# EAGLE design dual uln plane_new (EAGLE 5.10)
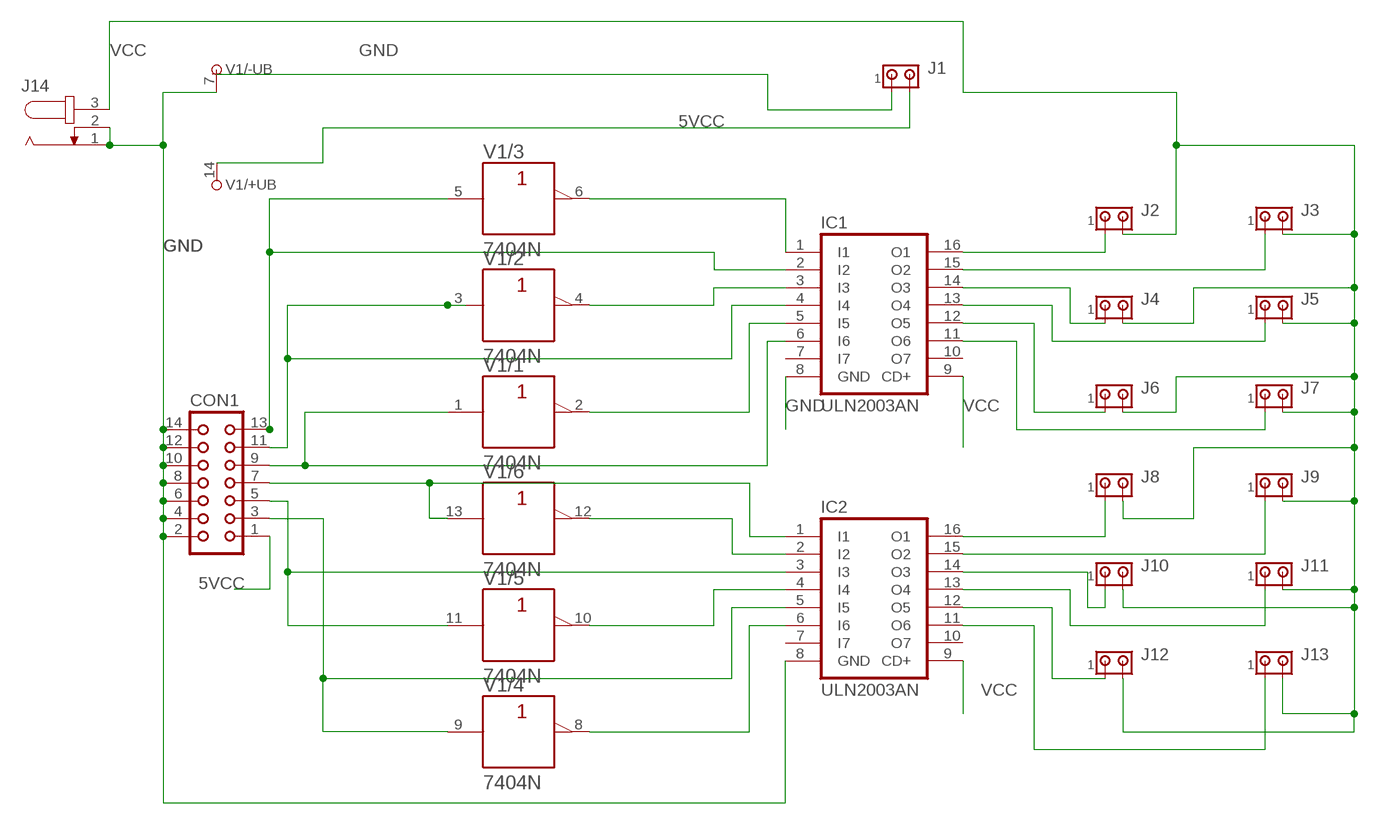
[diagram p0: schematic, sheet 1]

## Parts
CON1  CON14  [CON14]
IC1  ULN2003AN  [DIL16]
IC2  ULN2003AN  [DIL16]
J1  MTA02-100  [10X02MTA]
J2  MTA02-100  [10X02MTA]
J3  MTA02-100  [10X02MTA]
J4  MTA02-100  [10X02MTA]
J5  MTA02-100  [10X02MTA]
J6  MTA02-100  [10X02MTA]
J7  MTA02-100  [10X02MTA]
J8  MTA02-100  [10X02MTA]
J9  MTA02-100  [10X02MTA]
J10  MTA02-100  [10X02MTA]
J11  MTA02-100  [10X02MTA]
J12  MTA02-100  [10X02MTA]
J13  MTA02-100  [10X02MTA]
J14  JACK-PLUG1  [SPC4078]
V1  7404N  [DIL14]

## Nets
5VCC: CON1.1 J1.2 V1.14(/+UB:+UB)
GND: CON1.2 CON1.4 CON1.6 CON1.8 CON1.10 CON1.12 CON1.14 IC1.8(GND) IC2.8(GND) J1.1 J14.1 J14.2 V1.7(/-UB:-UB)
N$1: IC1.3(I3) V1.4(/2:Y)
N$2: IC1.5(I5) V1.2(/1:Y)
N$3: CON1.13 IC1.2(I2) V1.5(/3:A)
N$4: CON1.7 IC2.1(I1) V1.13(/6:A)
N$5: CON1.11 IC1.4(I4) V1.3(/2:A)
N$6: IC1.1(I1) V1.6(/3:Y)
N$7: CON1.9 IC1.6(I6) V1.1(/1:A)
N$9: CON1.5 IC2.3(I3) V1.11(/5:A)
N$10: CON1.3 IC2.5(I5) V1.9(/4:A)
N$12: IC2.2(I2) V1.12(/6:Y)
N$13: IC2.4(I4) V1.10(/5:Y)
N$14: IC2.6(I6) V1.8(/4:Y)
N$15: IC1.16(O1) J2.1
N$16: IC1.15(O2) J3.1
N$17: IC1.14(O3) J4.1
N$18: IC1.13(O4) J5.1
N$19: IC1.12(O5) J6.1
N$20: IC1.11(O6) J7.1
N$21: IC2.16(O1) J8.1
N$22: IC2.15(O2) J9.1
N$23: IC2.14(O3) J10.1
N$24: IC2.13(O4) J11.1
N$25: IC2.12(O5) J12.1
N$26: IC2.11(O6) J13.1
VCC: IC1.9(CD+) IC2.9(CD+) J2.2 J3.2 J4.2 J5.2 J6.2 J7.2 J8.2 J9.2 J10.2 J11.2 J12.2 J13.2 J14.3
Unconnected: IC1.7(I7) IC1.10(O7) IC2.7(I7) IC2.10(O7)

## Library data of the parts
CON1 = con-harting:CON14: CONNECTOR
IC1 IC2 = uln-udn:ULN2003A: DRIVER ARRAY
J1-J13 = con-amp:MTA02-100: AMP connector
J14 = con-jack:JACK-PLUG: DC POWER JACK Power Jack, DC, Right Angle, Through Hole, Rated 5A at 16VDC, PC Terminals Distributor: Farnell (www.Farnell.de) Drawing: 84N1161.pdf / 84N1162.pdf Manufacturer: SPC Technology (www.spctechnology.com) Type: SPC4077 / SPC 4078
V1 = 74ttl-din:74*04: Hex INVERTER

## Board
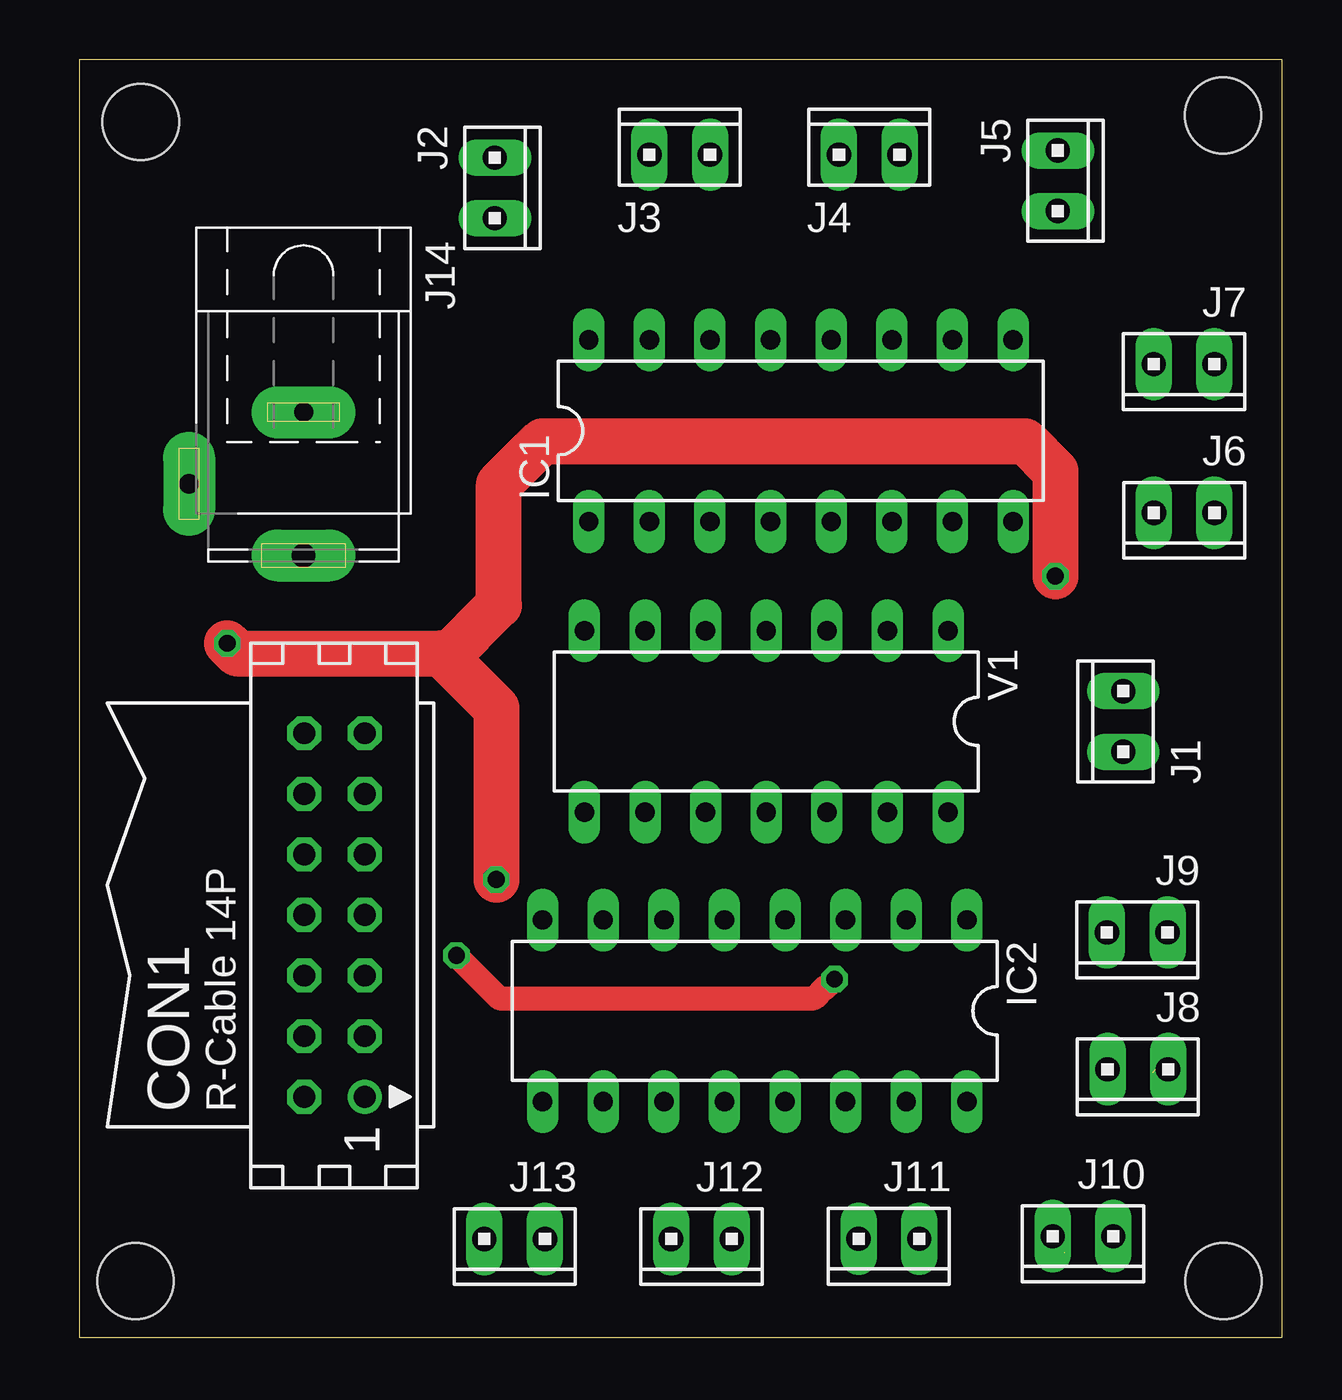
[diagram p1: board, top side]
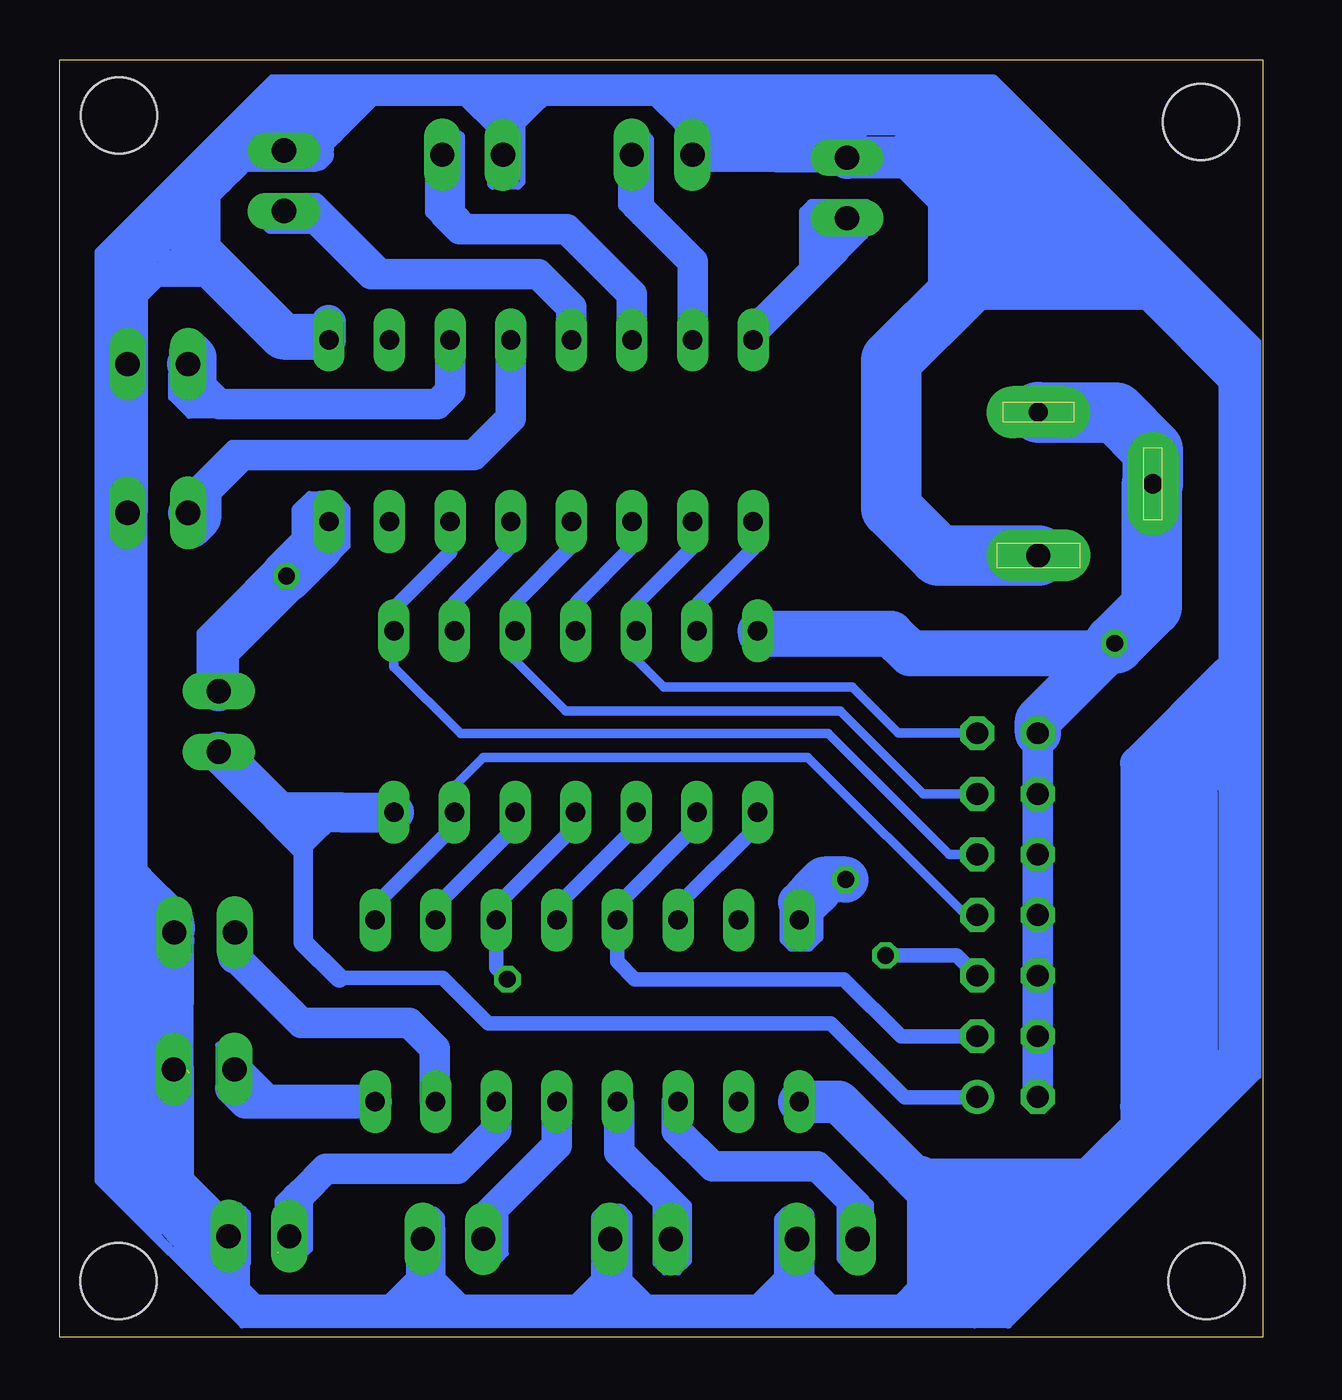
[diagram p2: board, bottom side, seen from below]

Size 50.41 x 53.57 mm. Coordinates in mm from the lower left corner, seen from the top.
Outline: 0,0 50.41,0 50.41,53.57 0,53.57 0,0
Copper layers (1*16): Top 0.035mm / dielectric 1.5mm / Bottom 0.035mm
Design rules "default *": minimum track width 10mil, minimum drill 24mil, track to track 50mil, track to pad 80mil, pad to pad 80mil, via to via 80mil, smd to smd 98mil, copper to edge 40mil, drill to drill 8mil, minimum pad ring 10mil, minimum via ring 8mil, stop-mask expansion 4mil, vias tented up to drill 0mil, thermal gap 10mil
Holes 3.2 mm at 2.58,50.95 2.35,2.36 47.95,2.36 47.93,51.23

### Footprints (pad centres in the part's own frame; a part is rotated, then mirrored left to right if it is on the bottom)
CON14 = drill 0.914 round: 1 -7.62,-1.27 | drill 0.914 octagon: 2 -7.62,1.27; 3 -5.08,-1.27; 4 -5.08,1.27; 5 -2.54,-1.27; 6 -2.54,1.27; 7 0,-1.27; 8 0,1.27; 9 2.54,-1.27; 10 2.54,1.27; 11 5.08,-1.27; 12 5.08,1.27; 13 7.62,-1.27; 14 7.62,1.27
DIL16 = drill 0.813 long: 1 -8.89,-3.81; 2 -6.35,-3.81; 3 -3.81,-3.81; 4 -1.27,-3.81; 5 1.27,-3.81; 6 3.81,-3.81; 7 6.35,-3.81; 8 8.89,-3.81; 9 8.89,3.81; 10 6.35,3.81; 11 3.81,3.81; 12 1.27,3.81; 13 -1.27,3.81; 14 -3.81,3.81; 15 -6.35,3.81; 16 -8.89,3.81
10X02MTA = drill 1.016 long: 1 1.27,0; 2 -1.27,0
SPC4078 = drill 0.8 pad 2.184 long: 1 -3,0; 2 0,-4.8 | drill 1 pad 2.184 long: 3 3,0
DIL14 = drill 0.813 long: 1 -7.62,-3.81; 2 -5.08,-3.81; 3 -2.54,-3.81; 4 0,-3.81; 5 2.54,-3.81; 6 5.08,-3.81; 7 7.62,-3.81; 8 7.62,3.81; 9 5.08,3.81; 10 2.54,3.81; 11 0,3.81; 12 -2.54,3.81; 13 -5.08,3.81; 14 -7.62,3.81

### Placement (x,y rotation side)
CON1  10.69,17.71 90 top
IC1  30.24,38.01 0 top
IC2  28.31,13.69 180 top
J1  43.75,25.82 90 top
J2  17.41,48.19 270 top
J3  25.16,49.58 0 top
J4  33.11,49.58 0 top
J5  41.01,48.49 270 top
J6  46.3,34.57 180 top
J7  46.3,40.8 180 top
J8  44.36,11.24 180 top
J9  44.34,16.98 180 top
J10  42.06,4.24 180 top
J11  33.93,4.13 180 top
J12  26.07,4.12 180 top
J13  18.24,4.12 180 top
J14  9.4,35.78 270 top
V1  28.79,25.82 180 top

### Tracks (layer width: path | path; a pad name or v marks a point on that pad's centre or on a via)
5VCC
  Bottom 0.305: 41.25,21.31 40.35,20.41 40.2,20.41 | 40.15,20.51 40.18,20.49 | 40.2,20.01 41.65,21.46
  Bottom 0.61: 40.2,20.41 40.2,20.46 40.18,20.49 38.65,22.01 | 40.85,21.56 40.85,21.21 40.15,20.51 40.15,21.01 40.2,21.06 40.7,21.06 41,21.36 | 38.7,15.06 34.35,15.06 32.45,13.16 18.1,13.16 15,10.06 11.99,10.06 CON1.1
  Bottom 0.813: 40.2,20.41 40.2,20.01 40.2,16.56 38.7,15.06
  Bottom 1.676: V1.14 38.65,22.01 41.21,22.01 J1.2
GND  (via drill 0.7)
  Top 1.93: v6.2,29.09 6.62,28.67 15.18,28.67 15.37,28.48 | v40.9,31.91 40.9,36.3 39.63,37.57 19.4,37.57 17.58,35.75 17.58,30.69 15.37,28.48 | v17.47,19.19 17.47,26.38 15.37,28.48
  Bottom 0.254: 38.45,34.36 38.45,34.06 38.35,33.96 | 38.45,34.86 38.45,33.26 38.85,32.86 38.85,32.66 38.35,33.16 38.35,33.96 | 38.45,34.86 38.35,34.76 38.35,33.96 | 38.85,35.26 38.45,34.86 | 38.85,35.26 39.45,35.26 39.55,35.36 39.05,35.36 38.85,35.16 38.85,35.26 | 38.85,35.26 38.95,35.36 39.95,35.36 40.55,34.76 40.55,33.56 44.55,29.56 44.55,27.66 | 44.55,27.56 44.55,27.66 | 44.55,27.56 44.35,27.36 44.15,27.36 | 44.15,27.36 40.45,31.06 41.15,31.06 44.55,27.66 | 44.55,27.56 44.55,27.06 44.25,26.76 | 44.15,27.36 44.02,27.36 J1.1
  Bottom 0.406: 18.6,17.31 18.6,16.76 19,16.36 19.75,16.36 20.05,16.66 20.05,18.46 19.7,18.81 | 18.6,17.31 18.6,17.76 18.65,17.76 18.8,17.91 | 18.6,17.31 19.3,17.31 19.75,16.86 19.7,16.86 19.5,16.66 19.3,16.66 19.2,16.76 19.05,16.76 18.85,16.96
  Bottom 1.016: 19.46,17.75 18.96,17.75 18.8,17.91 18.23,18.48 18.23,18.5 18.65,18.92
  Bottom 1.27: CON1.2 CON1.4 CON1.6 CON1.8 CON1.10 CON1.12 CON1.14 | 19.46,17.75 IC2.8 | v6.2,29.09 6.33,29.23
  Bottom 1.676: 19.46,18.25 19.09,18.62 18.94,18.62 | 21.03,29.49 V1.7 | J1.1 43.75,29.07 v40.9,31.91
  Bottom 1.778: IC1.8 39.58,34.2
  Bottom 1.93: 18.94,18.62 18.65,18.92 18.37,19.19 v17.47,19.19 | 21.03,29.49 15.57,29.49 14.75,28.67 6.62,28.67 v6.2,29.09 9.42,25.87 CON1.14
  Bottom 2.184: 39.58,34.2 39.58,33.23 v40.9,31.91 | 4.65,35.73 J14.2
  Bottom 2.54: J14.2 4.6,37.21 6.15,38.76 9.38,38.76 J14.1 | 4.65,35.73 4.65,30.64 v6.2,29.09
N$1
  Bottom 0.61: IC1.3 26.43,33.14 28.75,30.81 28.75,29.66 V1.4
N$2
  Bottom 0.61: IC1.5 31.51,33.16 33.85,30.81 33.85,29.64 V1.2
N$3
  Bottom 0.406: V1.5 26.25,28.41 25.1,27.26 17.2,27.26 15.27,25.33 CON1.13
  Bottom 0.61: IC1.2 23.89,33.13 26.25,30.76 V1.5
N$4
  Bottom 0.254: 33.9,22.05 V1.13
  Bottom 0.406: CON1.7 12.45,17.71 19.05,24.31 32.65,24.31 33.9,23.06 33.9,22.05
  Bottom 0.61: IC2.1 37.2,18.11 33.87,21.45 V1.13
N$5
  Bottom 0.406: CON1.11 14.23,22.79 17.7,26.26 29.2,26.26 31.35,28.41 31.35,29.6 V1.3
  Bottom 0.61: IC1.4 28.97,33.15 31.3,30.81 31.3,29.65 V1.3
N$6
  Bottom 0.61: IC1.1 21.35,33.07 23.65,30.76 23.65,29.68 V1.6
N$7
  Bottom 0.406: CON1.9 13.14,20.25 18.2,25.31 33.6,25.31 36.4,28.11 V1.1
  Bottom 0.61: IC1.6 34.05,32.92 36.4,30.56 V1.1
N$9  (via drill 0.7)
  Top 1.016: v31.65,15.01 31.3,14.66 31.24,14.66 30.79,14.22 17.6,14.22 v15.8,16.01
  Bottom 0.61: V1.11 28.79,21.43 32.15,18.06 32.15,17.53 IC2.3 32.12,15.48 v31.65,15.01 | CON1.5 12.81,16.01 v15.8,16.01
N$10
  Bottom 0.406: 27.05,17.48 IC2.5
  Bottom 0.61: IC2.5 27.05,17.51 27.05,18.11 23.71,21.46 V1.9 | 27.05,17.48 27.05,15.76 26.3,15.01 17.55,15.01 15.15,12.61 11.98,12.61 CON1.3
N$12
  Bottom 0.61: V1.12 31.33,21.39 34.7,18.01 34.7,17.54 IC2.2
N$13
  Bottom 0.61: V1.10 26.25,21.42 29.6,18.06 29.6,17.52 IC2.4
N$14
  Bottom 0.61: V1.8 21.17,21.45 24.5,18.11 IC2.6
N$15
  Bottom 0.406: 17.04,47.53 16.58,47.53 16.44,47.38 16.44,46.49 16.71,46.22 17.32,46.22 17.33,46.23 17.33,47.16 17.23,47.26 17.12,47.26 17.04,47.18 17.04,46.23 17.25,46.02 18.5,46.02 18.74,45.78 18.74,47.13 18.59,47.27 18.76,47.27 18.86,47.17 18.86,45.87 18.93,45.8 18.93,45.16 19.24,44.86 19.24,47.22 18.92,47.53 16.96,47.53 16.72,47.3 16.72,46.2 17.58,45.35 17.63,45.35 17.7,45.28 17.7,45.31 17.95,45.56
  Bottom 1.27: IC1.16 21.35,42.17 17.95,45.56 17.95,46.9 J2.1
N$16
  Bottom 0.406: 25.71,47.23 25.7,47.23 25.7,50.24 25.92,50.46 26.66,50.46 26.35,50.16 26,50.16 26,49.95 26.61,49.95 26.8,50.15 26.8,50.25 26.81,50.24 26.81,47.42 26.25,46.85 26.56,47.16 26.56,49.68 26.54,49.66 26.15,49.66 26.15,49.37 J3.1
  Bottom 1.27: IC1.15 23.89,45.1 26.25,47.46 26.25,49.27 J3.1
N$17
  Bottom 0.305: 33.84,46.45 33.84,46.46 33.75,46.56
  Bottom 0.406: 34.2,46.43 34.89,47.12 34.89,50.36 34.82,50.43 33.72,50.43 33.63,50.35 33.63,47.3 33.14,46.81 32.81,46.81 33.17,46.45 33.84,46.45 33.94,46.56 33.94,50.2 34.01,50.13 34.41,50.13 34.53,50.01 34.61,50.01 34.48,50.14 34.48,50.32 34.47,50.3 33.94,50.3 34.01,50.38 34.16,50.38 34.38,50.16 34.38,50.11 34.41,50.14 34.41,50.36
  Bottom 1.27: IC1.14 26.43,43.74 29.15,46.46 33.65,46.46 33.75,46.56 34.25,47.06 34.25,49.08 J4.1
N$18
  Bottom 0.305: 39.85,47.07 39.85,46.57 39.86,46.56
  Bottom 0.61: 39.03,45.88 39.72,46.56 39.86,46.56 41.56,46.56 41.7,46.71 41.7,47.49 41.2,46.99 41.2,46.96 41.53,47.29 41.53,47.62 41.47,47.68 39.64,47.68 36.49,44.52 36.46,44.52
  Bottom 1.27: IC1.13 28.97,43.18 30.35,44.56 37.35,44.56 39.85,47.07 40.47,47.07 J5.1
N$19
  Bottom 0.254: 45.24,35.49 43.25,37.48 43.24,37.48 43.23,37.49 42.83,37.49 | 42.83,37.49 42.82,37.5 43.22,37.5 43.26,37.46 | 42.83,37.49 42.83,37.07 42.75,36.99
  Bottom 1.27: IC1.12 31.51,38.54 33.05,36.99 42.75,36.99 44.48,35.26
  Bottom 1.676: 44.48,35.26 44.48,34.33 44.9,33.91 44.9,34.44 J6.1
N$20
  Bottom 0.254: 44.79,38.9 45.52,39.63 45.52,39.68 45.13,39.29 45.09,39.29 44.99,39.19 44.79,39.19 44.38,38.78 44.31,38.78 44.34,38.81 44.85,38.81 45.65,39.61 45.65,40.49 45.74,40.4 45.74,39.39 44.98,38.63 43.74,38.63 43.74,39.14 43.81,39.21
  Bottom 1.27: IC1.11 34.05,39.68 34.59,39.13 43.73,39.13 43.81,39.21 44.73,40.13
  Bottom 1.778: 44.73,40.13 44.73,41.1 44.93,41.3 44.93,40.9 J7.1
N$21
  Bottom 0.254: 41.04,10.31 41.36,10.31 42.51,11.47 42.51,12.17 42.81,12.46 43.52,12.46 43.69,12.29 43.72,12.29 43.77,12.24 43.77,10.42 43.75,10.4 | 43.75,10.4 43.75,11.83 43.3,12.28 42.9,12.28 42.83,12.21 42.83,12.18 42.68,12.02 42.68,11.38 42.7,11.35 42.7,11.15 42.75,11.1 42.57,11.1 42.49,11.18 42.49,11.19 42.57,11.27 42.97,11.27 43.07,11.16 | 43.07,11.16 43.11,11.12 43.59,11.12 43.62,11.1 43.62,11.33 43.55,11.39 43.55,11.64 43.56,11.65 43.56,11.73 43.33,11.95 43.23,11.95 43.15,12.04 43.05,12.04 43.01,12.08 43.01,12.02 42.86,11.88 42.86,11.59 42.87,11.59 42.87,11.43 42.94,11.36 43.37,11.36 43.4,11.39 43.4,11.46 43.25,11.62 43.25,11.72 43.23,11.74 43.05,11.74 43,11.79 43.05,11.85 43.05,11.62 43.02,11.59 43.25,11.59 43.36,11.7 43.36,12.12 43.46,12.22 43.63,12.22 43.63,12.21 43.63,12.2 43.63,12.19 43.63,11.94 43.26,11.56 42.91,11.56 42.82,11.65 42.82,11.71 42.82,11.72 | J8.1 43.09,11.18 43.07,11.16 | 43.75,10.4 43.23,10.4 43.18,10.44
  Bottom 1.422: 42.11,10.26 42.11,10.15 42.4,10.44 43.18,10.44 42.62,9.88 IC2.16
N$22
  Bottom 1.27: 43.07,15.96 40.29,13.18 35.77,13.18 34.7,12.11 34.7,9.92 IC2.15 | J9.1
  Bottom 1.422: 43.07,15.96 J9.1
N$23  (1 unrouted)
  Bottom 0.254: 41.02,3.8 41.05,3.8 41.23,3.98 41.23,5.78 40.95,6.06 40.28,6.06 | 40.28,6.06 39.93,5.72 39.93,3.68 40.23,3.39 41.1,3.39 41.27,3.56 | 40.28,6.06 40.26,6.06 40.24,6.08 | 41.27,3.55 41.27,5.76 40.91,6.11
  Bottom 1.27: IC2.14 32.12,8.7 33.75,7.06 39.25,7.06 40.24,6.08 40.55,5.76 40.55,4.07 J10.1
N$24
  Bottom 0.254: 31.71,5.55 31.71,3.51 31.95,3.28 31.95,4.66 31.84,4.77 31.84,3.4 32.07,3.17 32.07,3.45 32.12,3.49 32.12,3.24 32.26,3.1 32.96,3.1 33.15,3.29 32.42,3.29 32.41,3.28 32.38,3.28 32.3,3.35 32.94,3.35 33.05,3.46 33.2,3.46 33.21,3.47 33.21,5.12 | 33.21,5.12 32.6,5.73 | 33.21,5.12 33.22,5.11 33.22,5.05 | 33.22,5.05 33.26,5.01 33.26,3.39 33.04,3.17 | 33.22,5.05 32.64,5.05 32.55,4.96
  Bottom 1.27: IC2.13 29.58,8.04 32.55,5.06 32.55,4.96 32.55,4.05 J11.1
N$25
  Bottom 0.254: 24.52,6.05 | 24.52,6.05 24.03,5.56 24.03,3.17 24.48,2.72 25.06,2.72 25.43,3.09 25.43,5.57 25.48,5.62 | 24.52,6.05 24.52,5.98 24.84,5.65
  Bottom 1.27: J12.1 24.75,5.56 24.84,5.65 26.95,7.76 26.95,9.79 IC2.12
N$26
  Bottom 0.254: 16.61,5.81 16.61,5.77 | 16.61,5.81 16.41,5.61 16.41,3.12 17.6,3.12 17.71,3.24 17.71,5.55 | 16.61,5.81 16.79,5.81 17.05,5.55
  Bottom 1.27: 17.05,4.15 J13.1 17.05,4.15 | IC2.11 24.55,9.82 24.55,8.66 23.05,7.16 18.67,7.16 17.05,5.55 17.05,4.15
VCC  (1 unrouted)
  Bottom 0.254: 47.75,18.96 47.43,18.96 47.43,18.89 | 5.25,7.96 5.35,7.96 5.35,7.46 | 5.25,9.66 7.65,7.26 7.65,6.06 6.05,7.66 6.05,8.66 7.05,7.66 7.05,7.46 7.15,7.46 7.05,7.56 6.65,7.56 6.15,8.06 6.15,8.26 6.25,8.16 | 6.25,8.16 6.75,7.66 6.85,7.66 6.35,8.16 6.25,8.16 | 0.32,40.29 0.93,40.29 0.95,40.26 | 24.2,50.63 24.28,50.72 24.51,50.72 24.5,50.71 | 24.5,50.71 24.5,49.89 | 24.5,50.71 24.5,50.73 24.6,50.83 | 24.6,50.83 25.57,51.79 25.33,51.79 24.88,51.34 24.88,51.56 24.93,51.61 | 31.15,50.46 31.15,51.06 30.81,51.4 30.52,51.4 30.31,51.6 30.31,51.58 31.01,50.88 31.01,51.13 30.53,51.62 32.84,51.62 | 32.84,51.62 33.1,51.88 | 32.84,51.62 32.22,51 32.22,50.27 32.25,50.3 32.25,50.44 32.25,50.45 32.25,50.5 33.58,51.83 33.58,52.01 32.44,50.87 32.35,50.87 32.41,50.94 32.41,51.51 32.28,51.64 30.19,51.64 | 30.19,51.64 31.02,50.8 31.02,48.41 31.2,48.24 32.28,48.24 32.38,48.33 32.38,50.83 | 24.34,51.08 24.35,51.08 24.6,50.83 | 44.97,44.89 44.98,44.88 46.14,44.88 46.85,44.17 | 46.85,44.17 46.85,44.4 46.3,44.95 45.61,44.95 45.5,45.06 45.5,45.56 45.66,45.71 45.66,45.21 45.73,45.14 46.19,45.14 46.19,45.13 46.16,45.13 45.83,45.46 45.83,45.25 45.83,45.24 | 46.85,44.17 47.04,44.17 47.05,44.16 | 30.19,51.64 30.18,51.64 30.09,51.73 30.09,52.26 | 17.89,1.57 17.63,1.57 | 17.89,1.57 19.01,2.7 | 20.26,2.69 20.27,2.69 21.5,1.46 21.5,1.18 21.52,1.16 | 17.89,1.57 18.14,1.57 18.3,1.41 | 35.15,3.98 35.15,4.01 35.2,4.05 | 48.79,6.52 42.77,0.5 10.7,0.5 10.47,0.73 10.47,1.01 10.55,1.09 10.55,1.1 10.69,1.23 | 48.79,6.52 48.79,7.51 | 12.06,0.58 12.06,0.5 10.63,0.5 0.17,10.95 0.17,41.74 11.26,52.82 41.53,52.82 48.82,45.53 48.82,6.55
  Bottom 0.254: 48.82,6.55 47.46,5.2 | 48.82,6.55 48.79,6.52
  Bottom 0.305: 47.05,44.16 47.8,44.16 47.8,44.36 | 46.55,4.86 48.75,7.06 48.75,19.96 47.75,18.96 47.75,18.16 | 45.01,5.41 45.04,5.44 45.07,5.44 46.73,7.11 46.73,7.44 | 44.97,11.09 44.94,11.09 44.94,6.66 45.17,6.42 45.17,10.92 45.21,10.96
  Bottom 0.406: 13.95,1.36 18.3,1.36 18.95,0.72 20.34,0.72 20.43,0.81 19.79,0.81 19.64,0.96 26.5,0.96 26.72,0.73 27.91,0.73 27.95,0.77 34.58,0.77 34.62,0.73 35.77,0.73 35.81,0.77 42.87,0.77 46.21,4.11 48.71,6.77 48.71,7.18 46.71,5.23 46.22,4.48 46.22,4.76 45.59,4.02 46.35,5.09 45.16,3.45 43.86,2.16 | 43.86,2.16 43.8,2.1 | 43.86,2.16 43.86,2.52 45.19,3.84 45.19,3.87 45.46,4.14 45.51,4.14 44.19,5.46 42.93,5.46 42.74,5.28 42.74,3.43 43.05,3.73 43.05,5.17 43.38,4.84 43.38,4.62 43.54,4.46 43.73,4.46 43.51,4.68 43.51,4.8 43.44,4.88 43.44,5.17 43.55,5.06 43.82,5.06 43.85,5.02 43.85,4.67 43.9,4.62 44.04,4.62 44.28,4.86 44.28,4.97 44.11,5.14 44.04,5.14 44.05,5.16 | 45.09,11.2 45.42,10.87 45.42,7.19 | 45.42,7.19 45.42,5.83 45.78,6.18 45.78,6.4 45.75,6.42 45.75,10.36 45.63,10.48 J8.2 | 44.05,5.16 44.05,5.25 | 44.05,5.16 44.05,3.16 42.65,3.16 42.65,2.13 42,1.48 42.34,1.48 42.81,1.95 42.81,2.92 42.59,3.13 42.59,5.18 42.73,5.32 44.09,5.32 44.21,5.44 44.17,5.48 43.71,5.48 45.42,7.19 | 0.32,40.29 0.26,40.35 0.26,41 0.27,41.01 0.27,41.47 11.46,52.66 13.91,52.66 13.59,52.34 11.54,52.34
  Bottom 0.61: 11.54,52.34 0.52,41.32 0.52,41.14 5.85,46.48 12.64,46.48 | 34.55,4.55 34.55,1.97 34.01,1.44 36.11,1.44 36.16,1.49 36.05,1.49 35.59,1.95 35.59,5.01 35.43,5.18 34.73,5.18 34.57,5.02 34.57,4.55 34.77,4.55 35.1,4.87 35.1,4.77 35.2,4.67 35.2,4.05 35.2,3.83 35.15,3.78 35.15,2.92 36.71,1.36 33.35,1.36 33.34,1.36 33.41,1.36 35,2.95 35.16,2.95 36.71,1.41 | 25.46,1.36 25.64,1.36 27.09,2.81 27.35,2.81 28.75,1.41 28.57,1.41 27.77,2.2 | 27.77,2.2 27.85,2.2 27.86,2.21 27.86,2.26 27.84,2.28 27.84,2.39 | 27.84,2.39 27.84,5.04 27.58,5.3 26.95,5.3 26.8,5.14 | 26.8,5.14 | 26.8,5.14 26.71,5.06 26.71,2.18 26.73,2.16 | 27.83,2.45 27.83,2.58 | 27.83,2.45 28.69,1.59 | 27.29,1.83 27.4,1.83 27.77,2.2 | 27.83,2.45 27.83,2.39 27.84,2.39 | 21.14,1.34 20.17,2.3 20.17,4.95 19.92,5.2 19.15,5.2 19.09,5.14 19.09,2.3 18.29,1.5 18.21,1.5 18.3,1.41 18.3,1.36
  Bottom 0.813: 43.91,44.45 46.33,44.45 47.41,43.37 47.5,43.37 47.57,43.44
  Bottom 1.016: 13.1,5.06 13.1,3.66 13.05,3.71 11.85,3.71 | 41.25,52.26 42.45,51.07 42.45,50.2 42.67,49.98 42.67,49.44 42.59,49.36 39.76,49.36 39.71,49.41 39.58,49.41 39.42,49.57 39.42,49.82 39.6,50 39.62,50 | 40.04,49.67 39.95,49.67 | 40.04,49.67 J5.2 | 41.65,50.8 41.58,50.73 41.58,50.11 41.08,50.61 41.08,51.53 40.5,52.12 39.65,52.12 | 39.65,52.12 39.44,52.12 39.44,52.11 | 40.04,49.67 40.04,49.81 40.46,50.23 40.79,50.23 41.1,49.92 41.1,50.56 40.23,51.43 40.23,50.83 39.44,50.04 38.99,50.5 | 38.99,50.5 37.22,52.26 36.67,52.26 | 38.99,50.5 38.99,51.6 39.4,51.2 39.64,51.2 39.65,51.21 39.65,52.12 | 23.75,51.76 24.21,52.22 24.21,52.38 12.63,52.38 10.55,50.31 | 10.55,50.31 11.71,50.31 13.1,51.69 23.59,51.69 23.69,51.59 14.07,51.59 12.91,50.43 13.94,50.43 14.4,50.89 16.81,50.89 17.32,50.38 17.32,50.66 17.67,51.01 17.67,50.68 17.97,50.38 17.97,50.45 18.35,50.83 18.35,50.59 18.74,50.2 18.74,50.59 19,50.85 19,50.48 19.25,50.24 19.25,50.41 19.56,50.73 22.2,50.73 22.8,50.13 19.83,50.13 19.81,50.15 22.2,50.15 22.94,50.89 23.64,50.89 24.34,51.59 24.34,51.08 23.53,50.27 23.96,50.27 24.13,50.1 24.13,49.68 J3.2 | 4.65,43.96 4.65,44.41 10.55,50.31
  Bottom 1.27: 5.35,7.46 5.95,6.86 14.75,6.86 15.15,6.86 14.15,5.86 7.95,5.86 8.65,5.16 11.95,5.16 | J13.2 19.59,1.8 18.95,1.16 10.75,1.16 10.69,1.23 9.35,2.56 9.73,2.94 | 19.59,1.93 20.35,1.16 21.52,1.16 26.65,1.16 27.25,1.76 | 27.25,4.09 J12.2 27.29,1.83 27.95,1.16 34.55,1.16 35.15,1.76 35.75,1.16 42.65,1.16 43.13,1.64 J10.2 43.13,1.79 43.15,1.76 43.15,2.76 46.75,6.36 | 35.15,3.98 J11.2 | J2.2 23.49,49.49 J3.2 23.75,49.31 | J4.2 31.7,51.51 30.95,52.26 | 30.95,52.26 30.09,52.26 24.25,52.26 23.75,51.76 | 42.3,49.58 42.97,49.58 43.45,50.06 41.25,52.26 36.67,52.26 30.95,52.26 | 13.1,3.66 12.35,4.41 12.35,4.96 11.35,3.96 11.35,2.06 12.25,2.96 12.45,2.96 12.35,2.86 12.35,2.06 13.15,2.86 13.25,2.86 13.45,2.66 13.45,2.06 13.95,2.56 14.25,2.56 14.25,6.96 14.95,6.96 14.95,6.66 13.75,6.66 13.75,2.46 14.25,2.46 14.25,1.96 14.95,1.26 14.05,1.26 13.95,1.36 | 45.42,5.83 45.14,5.54 44.7,5.54 45.2,6.04 45.2,6.2 45.02,6.03 45.02,5.41 45.03,5.4 45.1,5.4 45.07,5.43 45.07,5.44 45.07,5.46 45.01,5.41
  Bottom 1.422: 45.73,16.5 45.89,16.5 45.92,16.53 | 45.95,11.6 45.95,11.35 J9.2 | 47.5,45.01 46.49,46.01 | 47.5,45.01 47.57,44.93 | 47.8,45.11 47.7,45.01 47.5,45.01 | 5.25,7.96 5.25,9.66 5.25,24.06 1.45,27.86 1.05,27.86 | 3.75,23.86 1.75,25.86 | 1.68,10.96 2.75,10.96 2.75,11.56 | J13.2 19.59,1.93 | 27.25,1.76 27.25,4.09 | 35.15,1.76 35.15,3.98 | IC1.9 39.13,42.54 39.15,42.56 39.15,42.26 39.45,41.96
  Bottom 1.676: J8.2 45.6,16.64 45.73,16.5 | 47.8,43.75 47.57,43.52 47.57,43.44 J7.2 J6.2 | 47.75,18.16 46.75,17.16 46.75,6.36 47.85,7.46 47.85,7.76 47.95,7.86 47.95,18.96 47.45,18.46 47.45,7.46 | 12.64,46.48 11.45,45.29 6.39,45.29 7.18,46.08 10.97,46.08 12.08,44.96 13.07,44.96 11.1,46.93 8.57,46.93 10.09,48.46 10.09,48.67 10.29,48.48 11.8,48.48 11.87,48.41 11.87,47.69 13.8,49.62 15.06,49.62 13.2,47.76 13.2,43.51
  Bottom 1.778: 11.85,3.71 8.95,3.71 7.63,5.04 | 3.75,23.86 3.75,23.76 2.75,22.76 2.75,11.56 4.25,10.06 4.25,14.06 3.75,14.56 3.75,22.66 4.25,23.16 | 0.95,27.96 1.05,27.86 | 0.95,27.96 0.95,40.26 4.65,43.96 12.55,43.96 | J2.2 10.18,49.49 | 6.37,6.27 6.14,6.27 0.95,11.46 0.95,23.86 2.15,23.86 2.35,23.66 2.35,23.96 1.55,24.76 | 1.55,24.76 1.55,26.36 | 1.55,24.76 1.55,24.56 0.95,23.96 0.95,27.96 | IC2.9 17.77,9.88 14.75,6.86
  Bottom 1.93: 7.88,4.78 8.56,4.1 | 39.45,41.96 41.05,41.96 44.65,45.56 44.65,48.26 44.05,48.86
  Bottom 2.184: 45.92,16.53 45.92,11.63 45.95,11.6 | 10.16,2.5 9.73,2.94 7.88,4.78 7.63,5.04 6.39,6.27 6.37,6.27 1.68,10.96 | 43.33,49.58 44.05,48.86 47.8,45.11 47.8,44.36 47.8,43.75 47.8,19.26 47.43,18.89 45.84,17.3 45.84,17.02 45.87,16.99
  Bottom 2.54: 12.55,43.96 15.55,40.96 15.55,34.76 13.57,32.78 J14.3